# Altium schematic sheet PN_IoT20201015.SchDoc
size A3
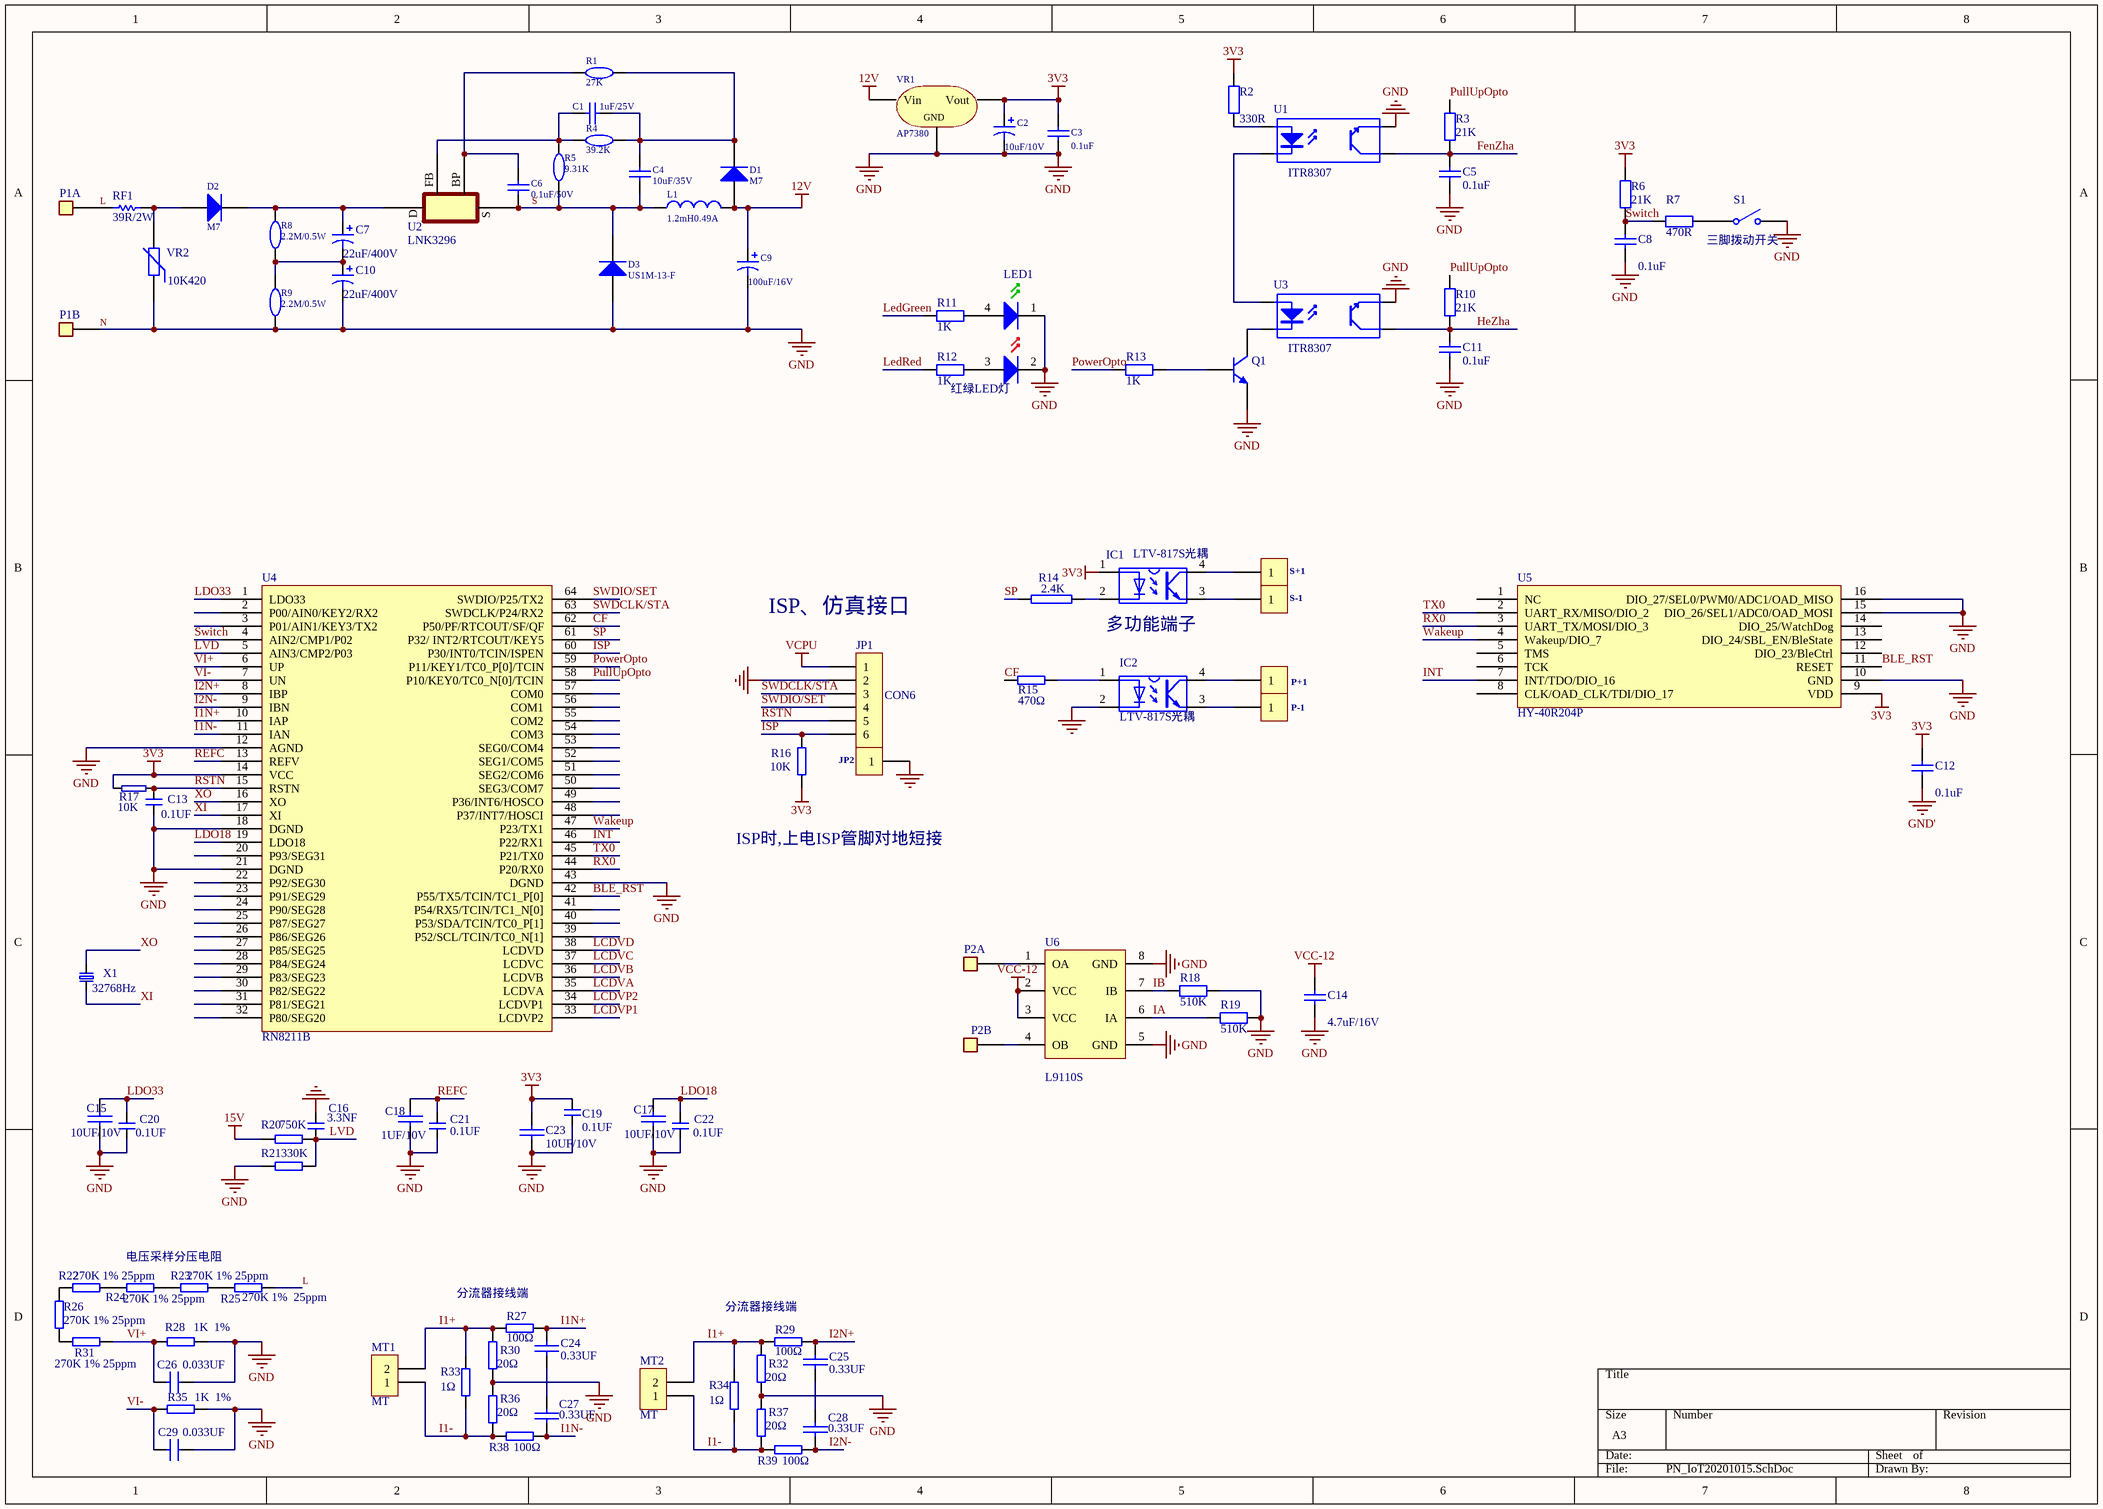
[diagram p0: PN_IoT20201015.SchDoc]

## Parts
C1  value 1uF/25V  [0805]  (hidden comment: 贴片电容)
C2  value 10uF/10V  [钽电容106]  (hidden comment: 钽电容)
C3  value 0.1uF  [0603]  (hidden comment: 电容)
C4  value 10uF/35V  [0805]  (hidden comment: 贴片电容)
C5  value 0.1uF  [0603]  (hidden comment: 电容)
C6  value 0.1uF/50V  [0805]  (hidden comment: 贴片电容)
C7  value 22uF/400V  [电容8*X22（脚距3.25）mm]  (hidden comment: 电解电容)
C8  value 0.1uF  [0603]  (hidden comment: 电容)
C9  value 100uF/16V  [470UF/10V]  (hidden comment: 电解电容)
C10  value 22uF/400V  [电容8*X22（脚距3.25）mm]  (hidden comment: 电解电容)
C11  value 0.1uF  [0603]  (hidden comment: 电容)
C12  value 0.1uF  [0603]  (hidden comment: 电容)
C13  0.1UF  [0603C]
C14  value 4.7uF/16V  [0805]  (hidden comment: 电容)
C15  10UF/10V  [0805C]
C16  3.3NF  [0603C]
C17  10UF/10V  [0805C]
C18  1UF/10V  [0805C]
C19  0.1UF  [0603C]
C20  0.1UF  [0603C]
C21  0.1UF  [0603C]
C22  0.1UF  [0603C]
C23  10UF/10V  [0805C]
C24  0.33UF  [0603C]
C25  0.33UF  [0603C]
C26  0.033UF  [0603C]
C27  0.33UF  [0603C]
C28  0.33UF  [0603C]
C29  0.033UF  [0603C]
D1  value M7  [SOD-123]  (hidden comment: 二极管)
D2  value M7  [SOD-123]  (hidden comment: 二极管)
D3  value US1M-13-F  [SMA]  (hidden comment: 二极管)
IC1  LTV-817S光耦  [RN-SO-4]
IC2  LTV-817S光耦  [RN-SO-4]
JP1  CON6  [SIP6]
JP2  (no value)  [sip1]
L1  value 1.2mH0.49A  [电感贴片8*8*4]  (hidden comment: 电感)
LED1  红绿LED灯  [红绿LED灯]
MT1  MT  [RN-2P-2.5-SMD]
MT2  MT  [RN-2P-2.5-SMD]
P1  Header2  (value not drawn)  (parts A,B of 2)
P2  Header2  (value not drawn)  (parts A,B of 2)
P+1  (no value)  [RN-1P-SMD]
P-1  (no value)  [RN-1P-SMD]
Q1  2N3904  [TO-92A]  (value not drawn)
R1  value 27K  [0805]  (hidden comment: 电阻)
R2  value 330R  [0603]  (hidden comment: 电阻)
R3  value 21K  [0603]  (hidden comment: 电阻)
R4  value 39.2K  [0805]  (hidden comment: 电阻)
R5  value 9.31K  [0805]  (hidden comment: 电阻)
R6  value 21K  [0603]  (hidden comment: 电阻)
R7  value 470R  [0603]  (hidden comment: 电阻)
R8  value 2.2M/0.5W  [0805]  (hidden comment: 电阻)
R9  value 2.2M/0.5W  [0805]  (hidden comment: 电阻)
R10  value 21K  [0603]  (hidden comment: 电阻)
R11  value 1K  [0603]  (hidden comment: 电阻)
R12  value 1K  [0603]  (hidden comment: 电阻)
R13  value 1K  [0603]  (hidden comment: 电阻)
R14  2.4K  [RN-0603]
R15  470Ω  [RN-0603]
R16  10K  [RN-0603]
R17  10K  [RN-0603]
R18  value 510K  [0603]  (hidden comment: 电阻)
R19  value 510K  [0603]  (hidden comment: 电阻)
R20  750K  [RN-0603]
R21  330K  [RN-0603]
R22  270K 1% 25ppm  [RN-1206]
R23  270K 1% 25ppm  [RN-1206]
R24  270K 1% 25ppm  [RN-1206]
R25  270K 1%  25ppm  [RN-1206]
R26  270K 1% 25ppm  [RN-1206]
R27  100Ω  [RN-0603]
R28  1K  1%  [RN-0603]
R29  100Ω  [RN-0603]
R30  20Ω  [RN-0603]
R31  270K 1% 25ppm  [RN-1206]
R32  20Ω  [RN-0603]
R33  1Ω  [RN-0805]
R34  1Ω  [RN-0805]
R35  1K  1%  [RN-0603]
R36  20Ω  [RN-0603]
R37  20Ω  [RN-0603]
R38  100Ω  [RN-0603]
R39  100Ω  [RN-0603]
RF1  value 39R/2W  [2W保险丝]  (hidden comment: 保险丝)
S1  三脚拨动开关  [三脚拨动开关2P专用]
S+1  (no value)  [RN-1P-SMD]
S-1  (no value)  [RN-1P-SMD]
U1  value ITR8307  [光电开关ITR8307]  (hidden comment: 光电开关)
U2  LNK3296
U3  value ITR8307  [光电开关ITR8307]  (hidden comment: 光电开关)
U4  RN8211B
U5  HY-40R204P  [蓝牙HY-40R204 P微型]
U6  器件名称: L9110S  [SOIC8]  (hidden comment: 电机驱动芯片)
VR1  value AP7380  [AP7380]  (hidden comment: 芯片)
VR2  value 10K420  [NTC/5D-7]  (hidden comment: 压敏电阻)
X1  32768Hz  [RN-CAY32.8]

## Nets
3V3: C2.1 C3.1 C12.2 C19.2 C23.1 IC1.1 R2.2 R6.2 R16.1 R17.2 U4.14(VCC) U5.9(VDD) VR1.3(Vout)
12V: C9.1 D1.1(A) L1.2 VR1.1(Vin)
15V: R20.1
GND': C12.1
N: C2.2 C3.2 C5.1 C8.1 C9.2 C10.2 C11.1 C13.1 C14.1 C15.2 C16.1 C17.2 C18.2 C19.1 C20.1 C21.1 C22.1 C23.2 C26.2 C29.2 D3.1(A) IC2.2 JP1.2 JP2.1 LED1.1 LED1.2 P1.2 Q1.1(E) R9.2 R18.2 R19.1 R21.1 R28.2 R30.2 R32.2 R35.1 R36.1 R37.1 S1.2(NO) U1.4(emitter) U3.4(emitter) U4.12(AGND) U4.18(DGND) U4.21(DGND) U4.43(DGND) U5.10(GND) U5.15(DIO_26/SEL1/ADC0/OAD_MOSI) U5.16(DIO_27/SEL0/PWM0/ADC1/OAD_MISO) U6.5(GND) U6.8(GND) VR1.2(GND) VR2.1  [also labelled GND]
S: C4.1 C6.1 D3.2(K) L1.1 R5.2 U2.5(S) U2.6(S) U2.7(S) U2.8(S)
VCC-12: C14.2 U6.2(VCC) U6.3(VCC)
VCPU: JP1.1
BLE_RST: U4.42(P55/TX5/TCIN/TC1_P[0]) U5.11(RESET)
CF: R15.1 U4.62(P50/PF/RTCOUT/SF/QF)
FenZha: C5.2 R3.1 U1.3(collector)
HeZha: C11.2 R10.1 U3.3(collector)
I1+: MT1.2 MT2.2 R27.2 R29.2 R30.1 R32.1 R33.1 R34.1
I1-: MT1.1 MT2.1 R33.2 R34.2 R36.2 R37.2 R38.1 R39.1
I1N+: C24.2 R27.1 U4.10(IAP)
I1N-: C27.1 R38.2 U4.11(IAN)
I2N+: C25.2 R29.1 U4.8(IBP)
I2N-: C28.1 R39.2 U4.9(IBN)
IA: R19.2 U6.6(IA)
IB: R18.1 U6.7(IB)
INT: U4.46(P22/RX1) U5.7(INT/TDO/DIO_16)
ISP: JP1.6 R16.2 U4.60(P30/INT0/TCIN/ISPEN)
L: P1.1 R25.1 RF1.2
LCDVA: U4.35(LCDVA)
LCDVB: U4.36(LCDVB)
LCDVC: U4.37(LCDVC)
LCDVD: U4.38(LCDVD)
LCDVP1: U4.33(LCDVP2)
LCDVP2: U4.34(LCDVP1)
LDO18: C17.1 C22.2 U4.19(LDO18)
LDO33: C15.1 C20.2 U4.1(LDO33)
LedGreen: R11.1
LedRed: R12.1
LVD: C16.2 R20.2 R21.2 U4.5(AIN3/CMP2/P03)
PowerOpto: R13.1 U4.59(P11/KEY1/TC0_P[0]/TCIN)
PullUpOpto: R3.2 R10.2 U4.58(P10/KEY0/TC0_N[0]/TCIN)
REFC: C18.1 C21.2 U4.13(REFV)
RSTN: C13.2 JP1.5 R17.1 U4.15(RSTN)
RX0: U4.44(P20/RX0) U5.3(UART_TX/MOSI/DIO_3)
SP: R14.2 U4.61(P32/_INT2/RTCOUT/KEY5)
SWDCLK/STA: JP1.3 U4.63(SWDCLK/P24/RX2)
SWDIO/SET: JP1.4 U4.64(SWDIO/P25/TX2)
Switch: C8.2 R6.1 R7.1 U4.4(AIN2/CMP1/P02)
TX0: U4.45(P21/TX0) U5.2(UART_RX/MISO/DIO_2)
VI+: C26.1 R28.1 R31.2 U4.6(UP)
VI-: C29.1 R35.2 U4.7(UN)
Wakeup: U4.47(P23/TX1) U5.4(Wakeup/DIO_7)
XI: U4.17(XI) X1.1
XO: U4.16(XO) X1.2
NetC1_1: C1.1 C4.2 D1.2(K) R1.1 R4.1
NetC1_2: C1.2 R4.2 R5.1 U2.2(FB)
NetC6_2: C6.2 R1.2 U2.1(BP/M)
NetC7_1: C7.1 D2.2(K) R8.1 U2.4(D)
NetC7_2: C7.2 C10.1 R8.2 R9.1
NetC24_1: C24.1 C27.2
NetC25_1: C25.1 C28.2
NetD2_1: D2.1(A) RF1.1 VR2.2
NetIC1_2: IC1.2 R14.1
NetIC1_3: IC1.3 S-1.1
NetIC1_4: IC1.4 S+1.1
NetIC2_1: IC2.1 R15.2
NetIC2_3: IC2.3 P-1.1
NetIC2_4: IC2.4 P+1.1
NetLED1_3: LED1.3 R12.2
NetLED1_4: LED1.4 R11.2
NetP2_1: P2.1 U6.1(OA)
NetP2_2: P2.2 U6.4(OB)
NetQ1_2: Q1.2(B) R13.2
NetQ1_3: Q1.3(C) U3.1(cathode)
NetR2_1: R2.1 U1.2(anode)
NetR7_2: R7.2 S1.1(COMMON)
NetR22_1: R22.1 R26.1
NetR22_2: R22.2 R24.2
NetR23_1: R23.1 R24.1
NetR23_2: R23.2 R25.2
NetR26_2: R26.2 R31.1
NetU1_1: U1.1(cathode) U3.2(anode)

Not connected (* = marked no-connect by the designer): U4 2(P00/AIN0/KEY2/RX2) 3(P01/AIN1/KEY3/TX2) 20(P93/SEG31) 22(P92/SEG30) 23(P91/SEG29) 24(P90/SEG28) 25(P87/SEG27) 26(P86/SEG26) 27(P85/SEG25) 28(P84/SEG24) 29(P83/SEG23) 30(P82/SEG22) 31(P81/SEG21) 32(P80/SEG20) 39(P52/SCL/TCIN/TC0_N[1]) 40(P53/SDA/TCIN/TC0_P[1]) 41(P54/RX5/TCIN/TC1_N[0]) 48(P37/INT7/HOSCI) 49(P36/INT6/HOSCO) 50(SEG3/COM7) 51(SEG2/COM6) 52(SEG1/COM5) 53(SEG0/COM4) 54(COM3) 55(COM2) 56(COM1) 57(COM0); U5 1(NC) 5(TMS) 6(TCK) 8(CLK/OAD_CLK/TDI/DIO_17) 12(DIO_23/BleCtrl) 13(DIO_24/SBL_EN/BleState) 14(DIO_25/WatchDog)

## Notes on the sheet
- (near JP1) ISP、仿真接口
- (near IC1) 多功能端子
- ISP时,上电ISP管脚对地短接
- 电压采样分压电阻
- 分流器接线端
- (in symbol LNK3604) BP

## Library data of the parts
C1 C4 C6 = 10uF: Published: 8-Jun-2000; LatestRevisionDate: 17-Jul-2002; LatestRevisionNote: Re-released for DXP Platform.; PackageReference: RAD-0.3; Publisher: Altium Limited
C2 = 10uF/10V: Published: 8-Jun-2000; LatestRevisionDate: 17-Jul-2002; LatestRevisionNote: Re-released for DXP Platform.; PackageReference: RB7.6-15; Publisher: Altium Limited
C3 = 0.1uF: Published: 8-Jun-2000; LatestRevisionDate: 17-Jul-2002; LatestRevisionNote: Re-released for DXP Platform.; PackageReference: RAD-0.3; Publisher: Altium Limited
C5 C8 C11 C12 C14 = Cap: Capacitor; Published: 8-Jun-2000; LatestRevisionDate: 17-Jul-2002; LatestRevisionNote: Re-released for DXP Platform.; PackageReference: RAD-0.3; Publisher: Altium Limited
C7 C10 = Cap Pol1: Polarized Capacitor (Radial); Published: 8-Jun-2000; LatestRevisionDate: 17-Jul-2002; LatestRevisionNote: Re-released for DXP Platform.; PackageReference: RB7.6-15; Publisher: Altium Limited
C9 = 100uF/16V: Published: 8-Jun-2000; LatestRevisionDate: 17-Jul-2002; LatestRevisionNote: Re-released for DXP Platform.; PackageReference: RB7.6-15; Publisher: Altium Limited
C13 C16 C19-C22 = CAP
C15 C17 C18 C23 C26 C29 = CAP: Capacitor
C24 C25 C27 C28 = C: Part Field 1: 多层片式陶瓷电容  COG 50V 223±5%; Part Field 2: 三星公司/风华公司; Part Field 3: 0.018
D1-D3 = M7: Published: 8-Jun-2000; LatestRevisionDate: 17-Jul-2002; LatestRevisionNote: Re-released for DXP Platform.; DatasheetDocument: 1998; PackageDocument: Aug-1999; PackageReference: DO-41; Publisher: Altium Limited; Code_JEDEC: DO-204-AL; ComponentLink1Description: Manufacturer Link; ComponentLink1URL: http://www.fairchildsemi.com/; ComponentLink2Description: Datasheet; ComponentLink2URL: http://www.fairchildsemi.com/ds/1N%2F1N4001.pdf
IC1 IC2 = 2501-1
JP1 = CON6: Connector
JP2 P+1 P-1 S+1 S-1 = CON1: Connector
L1 = 1mH: Code_IEC: 1005; Published: 8-Jun-2000; LatestRevisionDate: 17-Jul-2002; LatestRevisionNote: Re-released for DXP Platform.; PackageReference: 0402-A; Publisher: Altium Limited; Code_JEITA: 0402
MT1 MT2 = CON2: Connector
Q1 = 2N3904: NPN General Purpose Amplifier; Published: 8-Jun-2000; LatestRevisionDate: 15-Jan-2003; LatestRevisionNote: PCB Footprint 'BCY-W3/D4.7' replaced; DatasheetDocument: 1997; PackageDocument: Sep-1998; PackageReference: TO-92A; Publisher: Altium Limited; Code_JEDEC: TO-92A; ComponentLink1Description: Manufacturer Link; ComponentLink1URL: http://www.fairchildsemi.com/; ComponentLink2Description: Datasheet; ComponentLink2URL: http://www.fairchildsemi.com/ds/2N%2F2N3904.pdf
R1 R4 R5 R8 R9 = 390R: Published: 8-Jun-2000; LatestRevisionDate: 17-Jul-2002; LatestRevisionNote: Re-released for DXP Platform.; PackageReference: AXIAL-0.4; Publisher: Altium Limited
R2 R3 R6 R7 R10-R13 R18 R19 = Res2: Resistor; Published: 8-Jun-2000; LatestRevisionDate: 17-Jul-2002; LatestRevisionNote: Re-released for DXP Platform.; PackageReference: AXIAL-0.4; Publisher: Altium Limited
R14 = RES2
R15 R16 R20-R39 = RES
R17 = RES_S
RF1 = Res Semi: Semiconductor Resistor; Published: 8-Jun-2000; LatestRevisionDate: 17-Jul-2002; LatestRevisionNote: Re-released for DXP Platform.; PackageReference: AXIAL-0.5; Publisher: Altium Limited
S1 = SW-SPST: Single-Pole, Single-Throw Switch; Published: 24-Mar-1999; LatestRevisionDate: 17-Jul-2002; LatestRevisionNote: Re-released for DXP Platform.; PackageReference: SPST-2; Publisher: Altium Limited
U1 U3 = Component_1
U2 = LNK3604
U5 = HY-40R204P: Value: 蓝牙HY-40R204P
U6 = L9110S马达驱动芯片
VR1 = AP7380: Published: 24-Mar-1999; LatestRevisionDate: 17-Jul-2002; LatestRevisionNote: Re-released for DXP Platform.; PackageReference: D2PAK; Publisher: Altium Limited; Code_JEDEC: SMD-220
VR2 = Res Varistor: Varistor (Voltage-Sensitive Resistor); Published: 24-Mar-1999; LatestRevisionDate: 04-Mar-2005; LatestRevisionNote: PCB Footprint replaced.; PackageReference: 6-0805; Publisher: Altium Limited
X1 = OSC
LED1 = 红绿LED灯: Value: 红绿LED灯